# Altium schematic sheet 00_Main.SchDoc
size A4
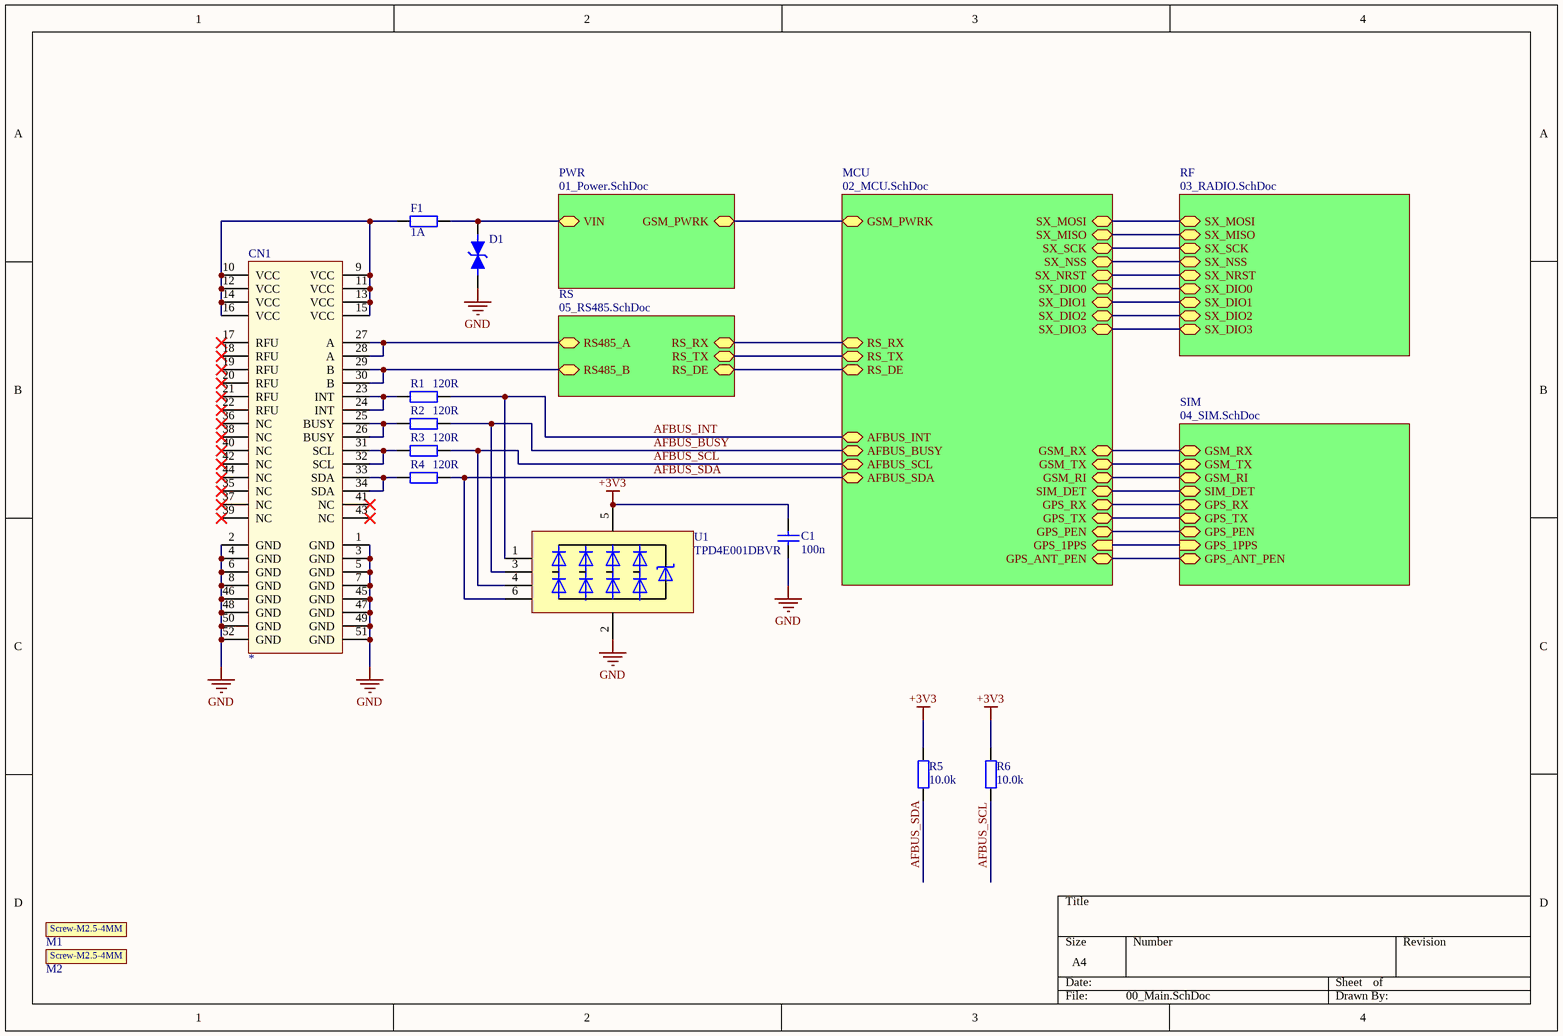
[diagram p0: 00_Main.SchDoc]

## Parts
C1  100n  [C0603_IPC_MD]
CN1  *  [PCI-E-MINI]  (no BOM)
D1  824501121  [DIOM4227X25N]  (value not drawn)
F1  1A  [R0603_IPC_MD]
M1  Screw-M2.5-4MM  (value not drawn)  (mechanical)
M2  Screw-M2.5-4MM  (value not drawn)  (mechanical)
R1  120R  [R0603_IPC_MD]
R2  120R  [R0603_IPC_MD]
R3  120R  [R0603_IPC_MD]
R4  120R  [R0603_IPC_MD]
R5  10.0k  [R0603_IPC_MD]
R6  10.0k  [R0603_IPC_MD]
U1  TPD4E001DBVR  [SOT23-6]

## Sub-sheets
MCU = 02_MCU.SchDoc: GSM_PWRK, RS_RX, RS_TX, RS_DE, SX_MOSI, SX_MISO, SX_SCK, SX_NSS, SX_NRST, SX_DIO1, SX_DIO2, SX_DIO3, SX_DIO0, AFBUS_SDA, AFBUS_SCL, AFBUS_BUSY, AFBUS_INT, GSM_RX, GSM_TX, GSM_RI, GPS_RX, GPS_TX, GPS_PEN, GPS_1PPS (in), SIM_DET, GPS_ANT_PEN
PWR = 01_Power.SchDoc: VIN, GSM_PWRK
RF = 03_RADIO.SchDoc: SX_MOSI, SX_MISO, SX_SCK, SX_NSS, SX_NRST, SX_DIO0, SX_DIO1, SX_DIO2, SX_DIO3
RS = 05_RS485.SchDoc: RS485_A, RS485_B, RS_RX, RS_TX, RS_DE
SIM = 04_SIM.SchDoc: GSM_RX, GSM_TX, GSM_RI, GPS_RX, GPS_TX, GPS_PEN, GPS_1PPS (in), SIM_DET, GPS_ANT_PEN

## Nets
+3V3: C1.1 R5.2 R6.2 U1.5(VCC)
GND: C1.2 CN1.1(GND) CN1.2(GND) CN1.3(GND) CN1.4(GND) CN1.5(GND) CN1.6(GND) CN1.7(GND) CN1.8(GND) CN1.45(GND) CN1.46(GND) CN1.47(GND) CN1.48(GND) CN1.49(GND) CN1.50(GND) CN1.51(GND) CN1.52(GND) D1.1 U1.2(GND)
AFBUS_BUSY: R2.2 U1.3(IO2) ; sheet MCU/AFBUS_BUSY
AFBUS_INT: R1.2 U1.1(IO1) ; sheet MCU/AFBUS_INT
AFBUS_SCL: R3.2 R6.1 U1.4(IO3) ; sheet MCU/AFBUS_SCL
AFBUS_SDA: R4.2 R5.1 U1.6(IO4) ; sheet MCU/AFBUS_SDA
NetCN1_9: CN1.9(VCC) CN1.10(VCC) CN1.11(VCC) CN1.12(VCC) CN1.13(VCC) CN1.14(VCC) CN1.15(VCC) CN1.16(VCC) F1.1
NetCN1_23: CN1.23(INT) CN1.24(INT) R1.1
NetCN1_25: CN1.25(BUSY) CN1.26(BUSY) R2.1
NetCN1_27: CN1.27(A) CN1.28(A) ; sheet RS/RS485_A
NetCN1_29: CN1.29(B) CN1.30(B) ; sheet RS/RS485_B
NetCN1_31: CN1.31(SCL) CN1.32(SCL) R3.1
NetCN1_33: CN1.33(SDA) CN1.34(SDA) R4.1
NetD1_2: D1.2 F1.2 ; sheet PWR/VIN
(unnamed): sheet RS/RS_RX, sheet MCU/RS_RX
(unnamed): sheet RS/RS_TX, sheet MCU/RS_TX
(unnamed): sheet RS/RS_DE, sheet MCU/RS_DE
(unnamed): sheet PWR/GSM_PWRK, sheet MCU/GSM_PWRK
(unnamed): sheet SIM/GSM_RX, sheet MCU/GSM_RX
(unnamed): sheet SIM/GSM_TX, sheet MCU/GSM_TX
(unnamed): sheet SIM/GSM_RI, sheet MCU/GSM_RI
(unnamed): sheet SIM/GPS_RX, sheet MCU/GPS_RX
(unnamed): sheet SIM/GPS_TX, sheet MCU/GPS_TX
(unnamed): sheet SIM/GPS_PEN, sheet MCU/GPS_PEN
(unnamed): sheet SIM/GPS_1PPS, sheet MCU/GPS_1PPS
(unnamed): sheet SIM/SIM_DET, sheet MCU/SIM_DET
(unnamed): sheet SIM/GPS_ANT_PEN, sheet MCU/GPS_ANT_PEN
(unnamed): sheet MCU/SX_MOSI, sheet RF/SX_MOSI
(unnamed): sheet MCU/SX_MISO, sheet RF/SX_MISO
(unnamed): sheet MCU/SX_SCK, sheet RF/SX_SCK
(unnamed): sheet MCU/SX_NSS, sheet RF/SX_NSS
(unnamed): sheet MCU/SX_NRST, sheet RF/SX_NRST
(unnamed): sheet MCU/SX_DIO1, sheet RF/SX_DIO1
(unnamed): sheet MCU/SX_DIO2, sheet RF/SX_DIO2
(unnamed): sheet MCU/SX_DIO3, sheet RF/SX_DIO3
(unnamed): sheet MCU/SX_DIO0, sheet RF/SX_DIO0

Not connected (* = marked no-connect by the designer): CN1 17(RFU)* 18(RFU)* 19(RFU)* 20(RFU)* 21(RFU)* 22(RFU)* 35(NC)* 36(NC)* 37(NC)* 38(NC)* 39(NC)* 40(NC)* 41(NC)* 42(NC)* 43(NC)* 44(NC)*

## Library data of the parts
C1 = CL10B104KO8WPNC: CAP CER 0.1UF 16V X7R 0603; Manufacturer: Samsung Electro-Mechanics; Manufacturer Part Number: CL10B104KO8WPNC; Voltage: 16V; Value: 100n; Dielectric: X7R; Supplier 1: Digi-Key; Supplier Part Number 1: 1276-6582-1-ND
CN1 = ALAFASAT_TRX_EDGE_CONN: EDGE CONN PCI EXP MINI 52POS; Manufacturer: *; Manufacturer Part Number: *; Supplier 1: *; Supplier Part Number 1: *
D1 = 824501121_TVS: TVS DIODE 12V 19.9V DO214AC; Manufacturer: Wurth Electronics Inc.; Voltage - Reverse Standoff (Typ): 12V (Max); Current - Average Rectified (Io): 1A; Manufacturer Part Number: 824501121; Supplier 1: Digi-Key; Supplier Part Number 1: 732-9949-1-ND
F1 = MFU0603FF01000P500: FUSE BOARD MOUNT 1A 32VDC 0603; Manufacturer: Bourns Inc.; Value: 1A; Manufacturer Part Number: MFU0603FF01000P500; Supplier 1: Digi-Key; Supplier Part Number 1: 749-1742-1-ND
M1 M2 = Screw-M2.5-4MM: Manufacturer: China; Manufacturer Part Number: Screw-M2.5-4MM; Supplier 1: Aliexpress; Supplier Part Number 1: Screw-M2.5-4MM
R1-R4 = RC0603JR-07120RL: RES SMD 120 OHM 5% 1/10W 0603; Manufacturer: Yageo; Value: 120R; Tolarance: 5%; Manufacturer Part Number: RC0603JR-07120RL; Supplier 1: Digi-Key; Supplier Part Number 1: 311-120GRCT-ND
R5 R6 = RMCF0603FT10K0: RES 10K OHM 1% 1/10W 0603; Manufacturer: Stackpole Electronics Inc; Value: 10.0k; Tolarance: 1%; Manufacturer Part Number: RMCF0603FT10K0; Supplier 1: Digi-Key; Supplier Part Number 1: RMCF0603FT10K0CT-ND
U1 = TPD4E001DBVR: 4x TVS DIODE 5.5V SOT23-6; Manufacturer: TI; Manufacturer Part Number: TPD4E001DBVR; Supplier 1: Digi-Key; Supplier Part Number 1: 296-28203-1-ND